# EAGLE design SAMD21 (EAGLE 9.4.2)
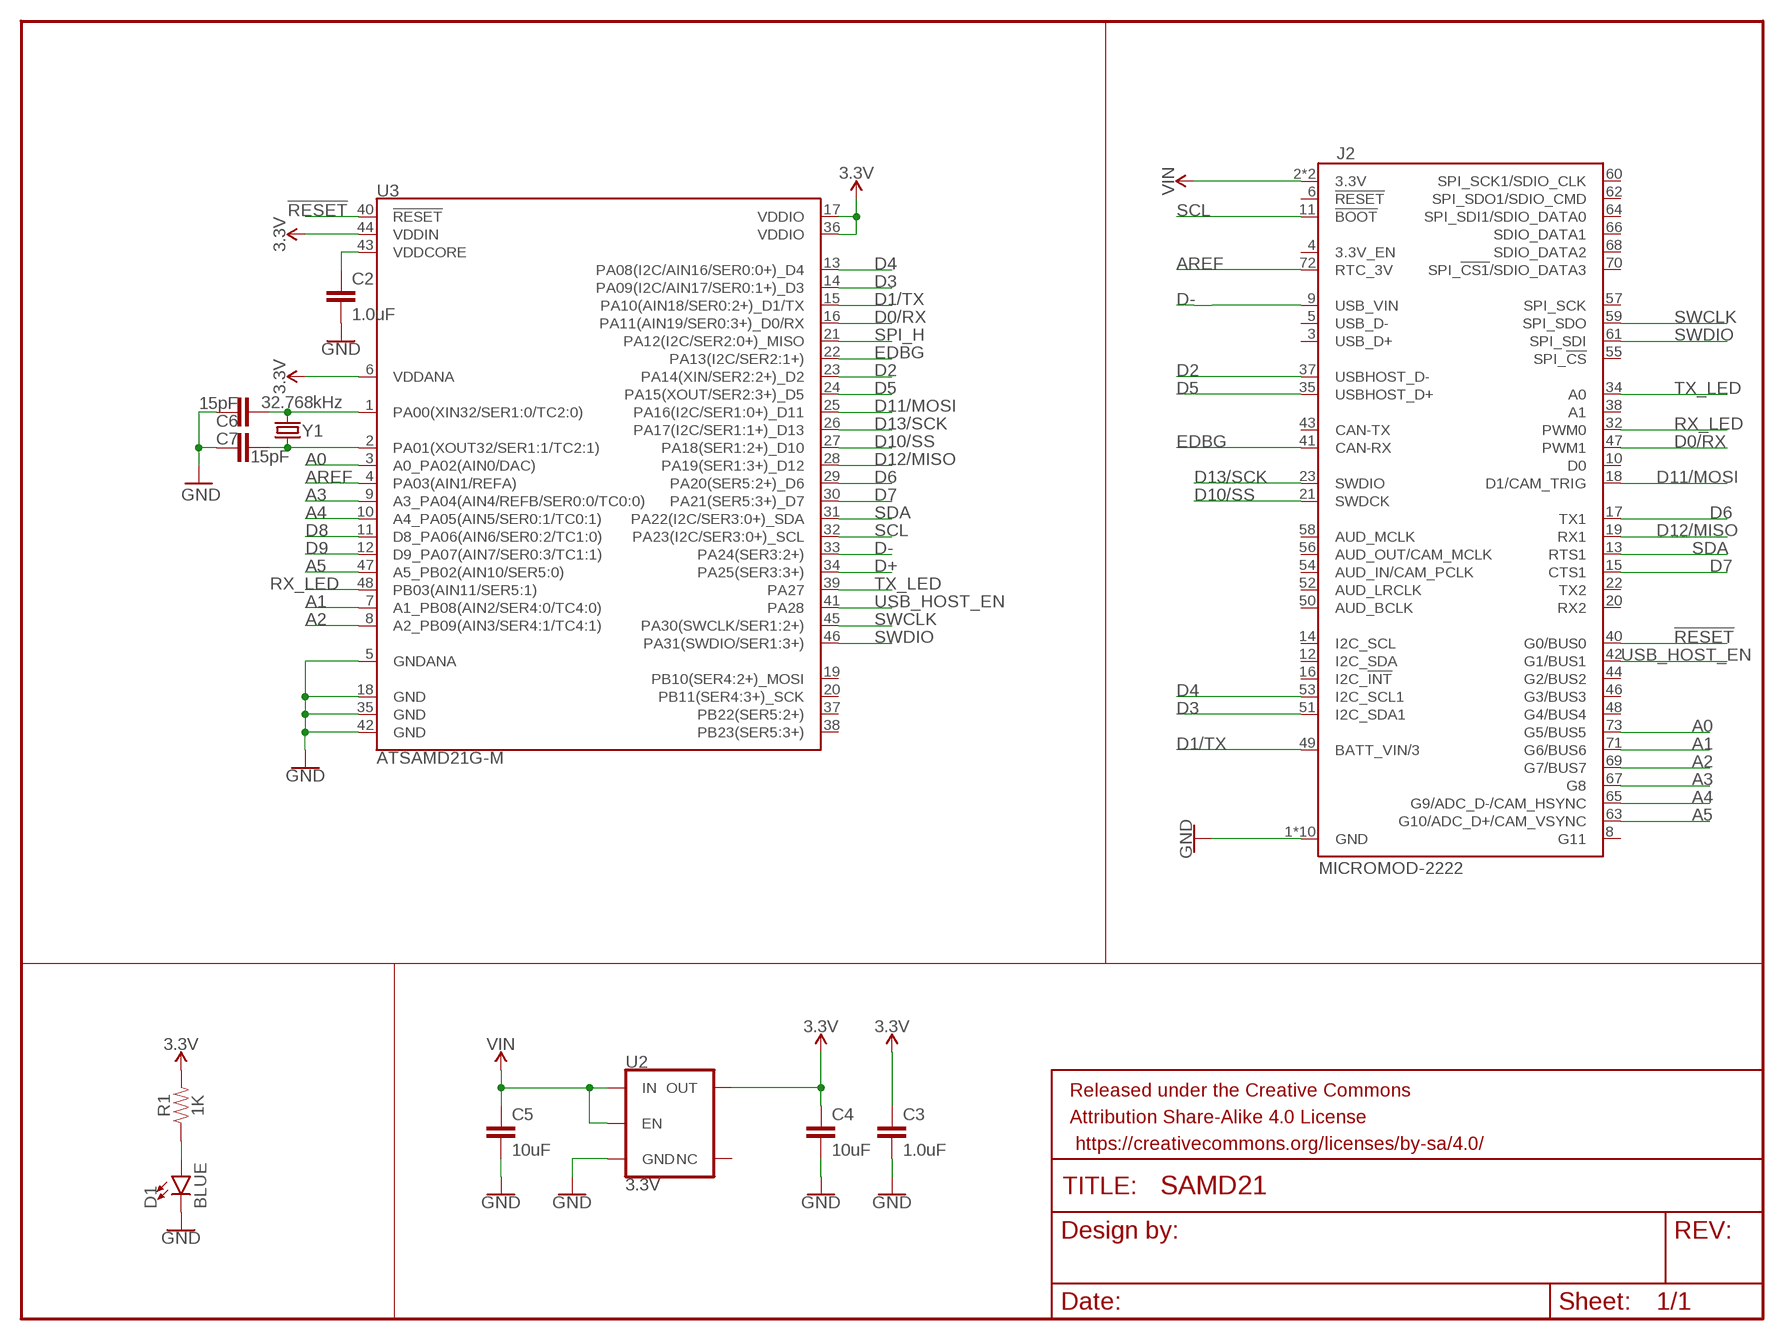
[diagram p0: schematic, sheet 1]

## Parts
C2  1.0uF  1.0UF-0603-16V-10%-X7R  [0603]
C3  1.0uF  1.0UF-0603-16V-10%-X7R  [0603]
C4  10uF  10UF-0603-6.3V-20%  [0603]
C5  10uF  10UF-0603-6.3V-20%  [0603]
C6  15pF  15PF-50V(+-5%)(0402)  [0402-CAP]
C7  15pF  15PF-50V(+-5%)(0402)  [0402-CAP]
D1  BLUE  LED-BLUE0603  [LED-0603]
FRAME1  FRAME-LETTER  [CREATIVE_COMMONS]
J2  MICROMOD-2222  [M.2-CARD-E-22]
R1  1K  0.05OHM-0603-1/5W-1%  [0603]
U2  3.3V  V_REG_AP2112K-3.3V  [SOT23-5]
U3  ATSAMD21G-M  [QFN-48]
Y1  32.768kHz  CRYSTAL3.2X1.5MM  [CRYSTAL-SMD-3.2X1.5MM]

## Nets
3.3V: C3.1 C4.1 R1.2 U2.5(OUT) U3.6(VDDANA) U3.17(VDDIO) U3.36(VDDIO) U3.44(VDDIN)
!RESET: J2.40(G0/BUS0) U3.40(!RESET!)
A0: J2.73(G5/BUS5) U3.3(A0_PA02(AIN0/DAC))
A1: J2.71(G6/BUS6) U3.7(A1_PB08(AIN2/SER4:0/TC4:0))
A2: J2.69(G7/BUS7) U3.8(A2_PB09(AIN3/SER4:1/TC4:1))
A3: J2.67(G8) U3.9(A3_PA04(AIN4/REFB/SER0:0/TC0:0))
A4: J2.65(G9/ADC_D-/CAM_HSYNC) U3.10(A4_PA05(AIN5/SER0:1/TC0:1))
A5: J2.63(G10/ADC_D+/CAM_VSYNC) U3.47(A5_PB02(AIN10/SER5:0))
AREF: J2.72(RTC_3V) U3.4(PA03(AIN1/REFA))
D0/RX: J2.47(PWM1) U3.16(PA11(AIN19/SER0:3+)_D0/RX)
D1/TX: J2.49(BATT_VIN/3) U3.15(PA10(AIN18/SER0:2+)_D1/TX)
D2: J2.37(USBHOST_D-) U3.23(PA14(XIN/SER2:2+)_D2)
D3: J2.51(I2C_SDA1) U3.14(PA09(I2C/AIN17/SER0:1+)_D3)
D4: J2.53(I2C_SCL1) U3.13(PA08(I2C/AIN16/SER0:0+)_D4)
D5: J2.35(USBHOST_D+) U3.24(PA15(XOUT/SER2:3+)_D5)
D6: J2.17(TX1) U3.29(PA20(SER5:2+)_D6)
D7: J2.15(CTS1) U3.30(PA21(SER5:3+)_D7)
D8: U3.11(D8_PA06(AIN6/SER0:2/TC1:0))
D9: U3.12(D9_PA07(AIN7/SER0:3/TC1:1))
D10/SS: J2.21(SWDCK) U3.27(PA18(SER1:2+)_D10)
D11/MOSI: J2.18(D1/CAM_TRIG) U3.25(PA16(I2C/SER1:0+)_D11)
D12/MISO: J2.19(RX1) U3.28(PA19(SER1:3+)_D12)
D13/SCK: J2.23(SWDIO) U3.26(PA17(I2C/SER1:1+)_D13)
D+: U3.34(PA25(SER3:3+))
D-: J2.9(USB_VIN) U3.33(PA24(SER3:2+))
EDBG: J2.41(CAN-RX) U3.22(PA13(I2C/SER2:1+))
GND: C2.2 C3.2 C4.2 C5.2 C6.1 C7.2 D1.C J2.1(GND) J2.7(GND) J2.33(GND) J2.36(GND) J2.39(GND) J2.45(GND) J2.75(GND) J2.GND1(GND) J2.GND2(GND) J2.GND3(GND) U2.2(GND) U3.5(GNDANA) U3.18(GND) U3.35(GND) U3.42(GND)
N$1: D1.A R1.1
N$2: C6.2 U3.1(PA00(XIN32/SER1:0/TC2:0)) Y1.P$2
N$3: C7.1 U3.2(PA01(XOUT32/SER1:1/TC2:1)) Y1.P$1
N$5: C2.1 U3.43(VDDCORE)
RX_LED: J2.32(PWM0) U3.48(PB03(AIN11/SER5:1))
SCL: J2.11(!BOOT!) U3.32(PA23(I2C/SER3:0+)_SCL)
SDA: J2.13(RTS1) U3.31(PA22(I2C/SER3:0+)_SDA)
SPI_H: U3.21(PA12(I2C/SER2:0+)_MISO)
SWCLK: J2.59(SPI_SDO) U3.45(PA30(SWCLK/SER1:2+))
SWDIO: J2.61(SPI_SDI) U3.46(PA31(SWDIO/SER1:3+))
TX_LED: J2.34(A0) U3.39(PA27)
USB_HOST_EN: J2.42(G1/BUS1) U3.41(PA28)
VIN: C5.1 J2.2(3.3V) J2.74(3.3V) U2.1(IN) U2.3(EN)
Unconnected: J2.3(USB_D+) J2.4(3.3V_EN) J2.5(USB_D-) J2.6(!RESET!) J2.8(G11) J2.10(D0) J2.12(I2C_SDA) J2.14(I2C_SCL) J2.16(I2C_!INT!) J2.20(RX2) J2.22(TX2) J2.38(A1) J2.43(CAN-TX) J2.44(G2/BUS2) J2.46(G3/BUS3) J2.48(G4/BUS4) J2.50(AUD_BCLK) J2.52(AUD_LRCLK) J2.54(AUD_IN/CAM_PCLK) J2.55(SPI_!CS!) J2.56(AUD_OUT/CAM_MCLK) J2.57(SPI_SCK) J2.58(AUD_MCLK) J2.60(SPI_SCK1/SDIO_CLK) J2.62(SPI_SDO1/SDIO_CMD) J2.64(SPI_SDI1/SDIO_DATA0) J2.66(SDIO_DATA1) J2.68(SDIO_DATA2) J2.70(SPI_!CS1!/SDIO_DATA3) U2.4(NC) U3.19(PB10(SER4:2+)_MOSI) U3.20(PB11(SER4:3+)_SCK) U3.37(PB22(SER5:2+)) U3.38(PB23(SER5:3+))

## Library data of the parts
C2 C3 = SparkFun-Capacitors:1.0UF: 1µF ceramic capacitors A capacitor is a passive two-terminal electrical component used to store electrical energy temporarily in an electric field.; PROD_ID: CAP-13930
C4 C5 = SparkFun-Capacitors:10UF: 10.0µF ceramic capacitors A capacitor is a passive two-terminal electrical component used to store electrical energy temporarily in an electric field.; PROD_ID: CAP-11015
C6 C7 = samd21-temp:15PF-50V(+-5%)(0402); PROD_ID: CAP-13063
D1 = SparkFun-LED:LED-BLUE: Blue SMD LED Used in manufacturing of various products at SparkFun Packages: 0603 - SMD 0603 package [Product Link] <http://www.digikey.com/product-detail/en/SMLE12BC7TT86/511-1589-2-ND/1641808> 1206 - SMD1206 package [Product Link] <http://www.digikey.com/product-detail/en/lite-on-inc/LTST-C150TBKT/160-1643-1-ND/573584> SparkFun Products: ESP8266 Thing-Dev Board <https://www.sparkfun.com/products/13711> RedBoard <https://www.sparkfun.com/products/12757>; PROD_ID: DIO-08575
FRAME1 = SparkFun-Aesthetics:FRAME-LETTER: Schematic Frame - Letter Standard 8.5x11 US Letter frame
J2 = SparkFun-MicroMod:MICROMOD: MicroMod Connector Description: A card edge connector and mating PCB connector to allow various MicroMod Processor Boards to be coupled with various carrier boards of different capabilities. Based on the M.2 standard.
R1 = SparkFun-Resistors:0.05OHM: 0.05Ω resistor A resistor is a passive two-terminal electrical component that implements electrical resistance as a circuit element. Resistors act to reduce current flow, and, at the same time, act to lower voltage levels within circuits. - Wikipedia; PROD_ID: RES-12535; VALUE: 0.05
U2 = SparkFun-IC-Power:V_REG_AP2112: AP2112 - 600mA CMOS LDO Regulator w/ Enable The AP2112 is CMOS process low dropout linear regulator with enable function, the regulator delivers a guaranteed 600mA (min.) continuous load current. Features Output Voltage Accuracy: ±1.5% Output Current: 600mA (Min.) Foldback Short Current Protection: 50mA Enable Function to Turn ON/OFF VOUT Low Dropout Voltage (3.3V): 250mV (Typ.) @IOUT=600mA Excellent Load Regulation: 0.2%/A (Typ.) Excellent Line Regulation: 0.02%/V (Typ.) Low Quiescent Current: 55μA (Typ.) Low Standby Current: 0.01μA (Typ.) Low Output Noise: 50μVRMS PSRR: 100Hz -65dB, 1kHz -65dB OTSD Protection Stable with 1.0μF Flexible Cap: Ceramic, Tantalum and Aluminum Electrolytic Operation Temperature Range: -40°C to 85°C ESD: MM 400V, HBM 4000V; PROD_ID: VREG-12457
U3 = SparkFun-IC-Microcontroller:ATSAMD21G: Atmel SAMD21G SMART ARM-Based Microcontroller The Atmel ® | SMART ™ SAM D21 is a series of low-power microcontrollers using the 32-bit ARM ® Cortex ® -M0+ processor, and ranging from 32- to 64-pins with up to 256KB Flash and 32KB of SRAM. The SAM D21 devices operate at a maximum frequency of 48MHz and reach 2.46 CoreMark/MHz. They are designed for simple and intuitive migration with identical peripheral modules, hex compatible code, identical linear address map and pin compatible migration paths between all devices in the product series. All devices include intelligent and flexible peripherals, Atmel Event System for inter-peripheral signaling, and support for capacitive touch button, slider and wheel user interfaces. Datasheet <https://cdn.sparkfun.com/datasheets/Dev/Arduino/Boards/Atmel-42181-SAM-D21_Datasheet.pdf> SparkFun Products SparkFun SAMD21 Mini Breakout <https://www.sparkfun.com/products/13664> (DEV-13664) SparkFun SAMD21 Dev Breakout <https://www.sparkfun.com/products/13672> (DEV-13672) (DEV-14926); PROD_ID: IC-13064
Y1 = samd21-temp:CRYSTAL: Various standard crystals. Proven footprints.; PROD_ID: XTAL-13062

## Board
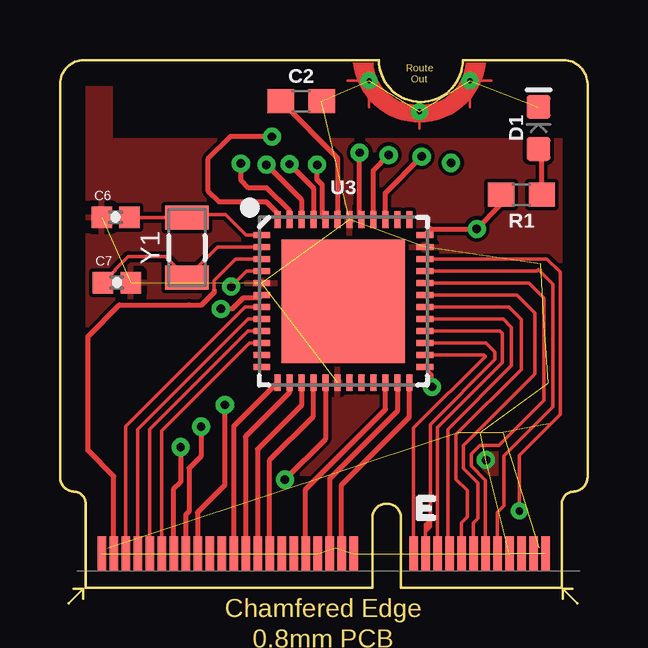
[diagram p1: board, top side]
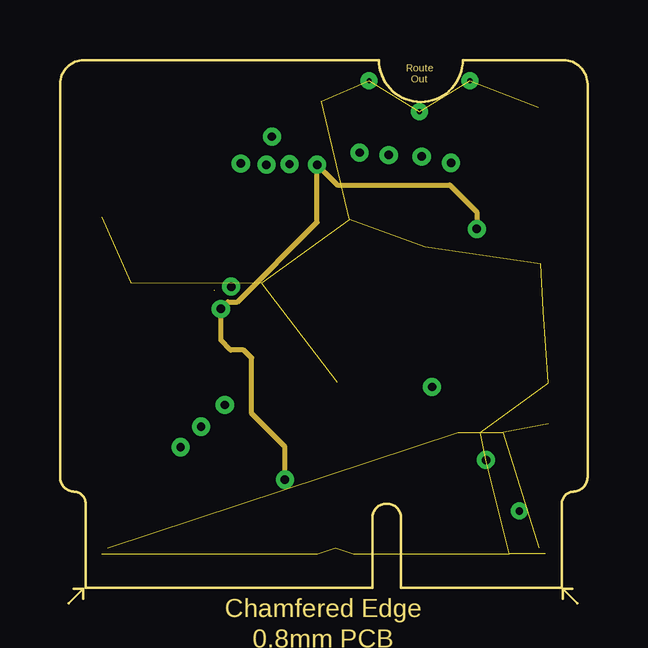
[diagram p2: board, inner layer Route15]
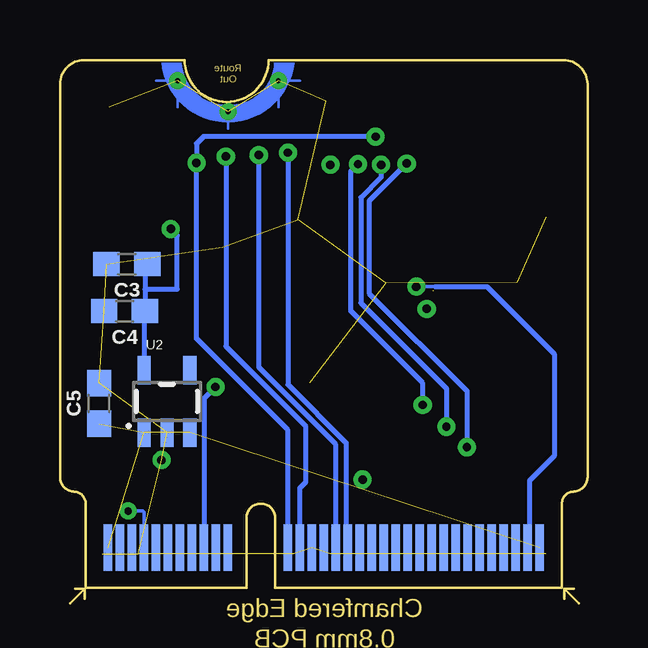
[diagram p3: board, bottom side, seen from below]

Size 22 x 22 mm. Coordinates in mm from the lower left corner, seen from the top.
Outline: 0,4.6 0,21 arc-87 1,22 13.3,22 arc90 15.05,20.25 arc90 16.8,22 21,22 arc-87 22,21 22,4.6
Outline: 0,4.6 arc87 0.6,4
Outline: 21.4,4 arc87 22,4.6
Outline: 21.4,4 arc85 20.93,3.5 20.93,0 14.23,0 14.23,2.9 arc180 13.03,2.9 13.03,0 1.08,0 1.08,3.5 arc84 0.6,4
Outline: 21.4,4 arc87 22,4.6
Outline: 0,4.6 arc87 0.6,4
Copper layers (1+2*15+16): Top 0.035mm / dielectric 1.5mm / Route2 0.035mm / dielectric 0.15mm / Route15 0.035mm / dielectric 0.2mm / Bottom 0.035mm
Design rules "default *": minimum track width 6mil, minimum drill 0.35mm, track to track 6mil, track to pad 6mil, pad to pad 6mil, via to via 6mil, smd to smd 6mil, copper to edge 40mil, drill to drill 6mil, minimum pad ring 10mil, minimum via ring 8mil, stop-mask expansion 4mil, vias tented up to drill 0mil, thermal gap 10mil

### Footprints (pad centres in the part's own frame; a part is rotated, then mirrored left to right if it is on the bottom)
0603 = smd 1.1 x 1: 1 -0.85,0; 2 0.85,0
0402-CAP = smd 0.85 x 0.9: 1 -0.58,0; 2 0.58,0
LED-0603 = smd 1 x 1: A -0.877,0; C 0.877,0
M.2-CARD-E-22 = smd 0.35 x 1.45: 1 9.25,1.275; 3 8.75,1.275; 5 8.25,1.275; 7 7.75,1.275; 9 7.25,1.275; 11 6.75,1.275; 13 6.25,1.275; 15 5.75,1.275; 17 5.25,1.275; 19 4.75,1.275; 21 4.25,1.275; 23 3.75,1.275; 33 1.25,1.275; 35 0.75,1.275; 37 0.25,1.275; 39 -0.25,1.275; 41 -0.75,1.275; 43 -1.25,1.275; 45 -1.75,1.275; 47 -2.25,1.275; 49 -2.75,1.275; 51 -3.25,1.275; 53 -3.75,1.275; 55 -4.25,1.275; 57 -4.75,1.275; 59 -5.25,1.275; 61 -5.75,1.275; 63 -6.25,1.275; 65 -6.75,1.275; 67 -7.25,1.275; 69 -7.75,1.275; 71 -8.25,1.275; 73 -8.75,1.275; 75 -9.25,1.275 | smd 0.35 x 1.95 bottom: 2 9,1.525; 4 8.5,1.525; 6 8,1.525; 8 7.5,1.525; 10 7,1.525; 12 6.5,1.525; 14 6,1.525; 16 5.5,1.525; 18 5,1.525; 20 4.5,1.525; 22 4,1.525; 32 1.5,1.525; 34 1,1.525; 36 0.5,1.525; 38 0,1.525; 40 -0.5,1.525; 42 -1,1.525; 44 -1.5,1.525; 46 -2,1.525; 48 -2.5,1.525; 50 -3,1.525; 52 -3.5,1.525; 54 -4,1.525; 56 -4.5,1.525; 58 -5,1.525; 60 -5.5,1.525; 62 -6,1.525; 64 -6.5,1.525; 66 -7,1.525; 68 -7.5,1.525; 70 -8,1.525; 72 -8.5,1.525; 74 -9,1.525 | drill 0.2: GND1 1.9,21; GND2 4,19.7; GND3 6.1,21
SOT23-5 = smd 0.55 x 1.2: 1 -0.95,-1.3; 2 0,-1.3; 3 0.95,-1.3; 4 0.95,1.3; 5 -0.95,1.3
QFN-48 = smd 0.7 x 0.25: 1 -3.4,2.75; 2 -3.4,2.25; 3 -3.4,1.75; 4 -3.4,1.25; 5 -3.4,0.75; 6 -3.4,0.25; 7 -3.4,-0.25; 8 -3.4,-0.75; 9 -3.4,-1.25; 10 -3.4,-1.75; 11 -3.4,-2.25; 12 -3.4,-2.75; 25 3.4,-2.75; 26 3.4,-2.25; 27 3.4,-1.75; 28 3.4,-1.25; 29 3.4,-0.75; 30 3.4,-0.25; 31 3.4,0.25; 32 3.4,0.75; 33 3.4,1.25; 34 3.4,1.75; 35 3.4,2.25; 36 3.4,2.75 | smd 0.25 x 0.7: 13 -2.75,-3.4; 14 -2.25,-3.4; 15 -1.75,-3.4; 16 -1.25,-3.4; 17 -0.75,-3.4; 18 -0.25,-3.4; 19 0.25,-3.4; 20 0.75,-3.4; 21 1.25,-3.4; 22 1.75,-3.4; 23 2.25,-3.4; 24 2.75,-3.4; 37 2.75,3.4; 38 2.25,3.4; 39 1.75,3.4; 40 1.25,3.4; 41 0.75,3.4; 42 0.25,3.4; 43 -0.25,3.4; 44 -0.75,3.4; 45 -1.25,3.4; 46 -1.75,3.4; 47 -2.25,3.4; 48 -2.75,3.4 | smd 5.15 x 5.15: EP 0,0
CRYSTAL-SMD-3.2X1.5MM = smd 1 x 1.8: P$1 -1.25,0; P$2 1.25,0

### Placement (x,y rotation side)
C2  10.06,20.27 0 top
C3  19.21,13.49 180 bottom
C4  19.3,11.53 180 bottom
C5  20.37,7.68 90 bottom
C6  2.32,15.44 0 top
C7  2.37,12.72 0 top
D1  19.95,19.16 90 top
FRAME1  -6.54,-17.26 0 top  (outside the outline)
J2  10.99,0.14 0 top
R1  19.24,16.38 180 top
U2  17.53,7.76 0 bottom
U3  11.82,11.94 0 top
Y1  5.3,14.17 90 top

### Tracks (layer width: path | path; a pad name or v marks a point on that pad's centre or on a via)
3.3V  (via drill 0.35)
  Top 0.2: U3.36 15.48,14.96 v17.38,14.96 18.39,15.97 R1.2 | U3.6 8.29,12.07 7.63,12.07 7.18,11.62 v6.71,11.62 | U3.44 10.94,15.47 10.94,16.78 10.72,17 v10.72,17.63 | U3.17 11.07,6.19 v9.38,4.5
  Route15 0.2: v17.38,14.96 17.38,15.67 16.26,16.79 11.57,16.79 v10.72,17.63 10.72,15.24 7.4,11.92 7.01,11.92 v6.71,11.62 6.71,10.32 7.12,9.9 7.66,9.9 7.99,9.57 7.99,7.26 9.38,5.87 v9.38,4.5
  Bottom 0.2: 18.45,12.44 18.45,12.45 17.11,12.45 17.11,14.69 v17.38,14.96
  Bottom 0.203: U2.5 18.48,11.5 C4.1 18.45,12.44 18.45,13.39 C3.1
!RESET  (via drill 0.35)
  Top 0.2: U3.40 13.07,17.39 v13.71,18.04
  Bottom 0.2: J2.40 10.5,5.96 13.71,9.18 v13.71,18.04
A0  (1 unrouted)
  Top 0.152: 2.2,1.46 J2.73 | U3.3 7.32,13.69 6.42,12.8 6.42,12.39 6.42,12.38
  Top 0.2: J2.73 2.24,4.64 1.17,5.71 1.17,10.48 2.47,11.78 5.38,11.78 5.91,11.78 6.45,12.32 6.45,12.38 6.45,12.39
A1
  Top 0.152: J2.71 2.75,6.72 7.72,11.69 U3.7
A2
  Top 0.152: J2.69 3.25,6.59 7.85,11.19 U3.8
A3
  Top 0.152: J2.67 3.75,6.59 7.84,10.69 U3.9
A4
  Top 0.152: J2.65 4.25,6.54 7.9,10.19 U3.10
A5  (via drill 0.35)
  Top 0.2: v5.03,5.85 5.03,4.39 4.72,4.09 4.72,1.44 J2.63 | U3.47 9.57,15.72 8.62,16.67 7.87,16.67 7.54,16.99 v7.54,17.68
  Bottom 0.2: v7.54,17.68 9.1,16.12 9.1,12.27 5.03,8.2 v5.03,5.85
AREF  (via drill 0.35)
  Top 0.152: U3.4 7.79,13.19 v7.14,12.55
  Bottom 0.152: v7.14,12.55 6.36,12.55 | J2.72
  Bottom 0.2: 6.36,12.55 4.19,12.55 1.4,9.75 1.4,5.49 2.42,4.46 2.42,1.75 J2.72
D0/RX
  Top 0.2: J2.47 8.75,5.32 10.57,7.14 U3.16
D1/TX
  Top 0.2: U3.15 10.07,7.59 8.24,5.76 J2.49
D2
  Top 0.2: U3.23 14.07,7.36 11.25,4.54 J2.37
D3
  Top 0.2: U3.14 9.57,8.14 7.73,6.3 7.73,1.43 J2.51
D4
  Top 0.2: U3.13 7.25,6.72 J2.53
D5
  Top 0.2: J2.35 11.75,4.28 14.57,7.11 U3.24
D6
  Top 0.152: U3.29 18.48,11.19 18.83,10.84 18.83,9.26 16.17,6.6 16.17,1.49 J2.17
D7
  Top 0.152: U3.30 18.71,11.69 19.24,11.17 19.24,9.1 16.51,6.38 16.51,4.52 16.98,4.05 16.98,2.94 16.75,2.7 J2.15
D10/SS
  Top 0.152: U3.27 17.76,10.19 18.13,9.82 18.13,9.5 15.44,6.81 15.44,2.83 | 15.44,2.83 15.44,2.52 15.25,2.33 J2.21 15.25,2.47 | 15.25,2.47 15.25,2.63 15.3,2.68 | 15.3,2.68 15.44,2.83 | 15.25,2.47 15.3,2.52 15.3,2.68
D11/MOSI  (via drill 0.35)
  Top 0.152: U3.25 15.51,8.9 v15.51,8.36
  Bottom 0.2: v15.51,8.36 16,7.88 J2.18
D12/MISO
  Top 0.152: J2.19 15.75,6.68 18.45,9.38 18.45,10.6 18.34,10.71 15.23,10.71 U3.28
D13/SCK
  Top 0.152: J2.23 14.75,6.65 17.73,9.64 17.68,9.69 U3.26
D+  (via drill 0.3)
  Top 0.152: U3.34 20.31,13.69 20.86,13.15 20.86,7.21 19.16,5.52 v19.16,3.19
  Bottom 0.152: v19.16,3.19 18.55,3.19 18.49,3.13 18.49,2.2 18.5,2.19
D-
  Top 0.152: U3.33 19.88,13.19 19.94,13.26 20.55,12.65 20.55,7.53 18.52,5.5 18.52,3.41 18.25,3.14 J2.9
EDBG
  Top 0.2: J2.41 10.25,4.1 13.58,7.43 13.58,8.53 U3.22
GND  (via drill 0.35)  (22 unrouted)
  other vias: 17.76,5.32
  pour Top: 0.9,20.81 0.9,4.76 21.13,4.76 21.13,18.65 16.27,18.65 2.12,18.65 2.12,20.83 2.12,21.39 0.88,21.39 0.88,20.58 0.88,20.58
N$1
  Top 0.2: R1.1 20.09,18.15 D1.A
N$2
  Top 0.152: U3.1 7.76,14.69 6.9,15.55 5.42,15.55 Y1.P$2 2.92,15.42 C6.2
N$3
  Top 0.152: C7.1 2.3,13.22 2.3,13.26 2.85,13.81 4.41,13.81 Y1.P$1 6.56,14.19 U3.2
N$5
  Top 0.2: C2.1 11.57,17.92 U3.43
RX_LED  (via drill 0.35)
  Top 0.2: v8.84,18.8 7.11,18.8 6.16,17.86 6.16,16.55 6.63,16.08 8.6,16.08 9.07,15.62 U3.48
  Bottom 0.2: v8.84,18.8 16.02,18.8 16.31,18.51 v16.31,17.71 16.31,10.38 12.5,6.57 J2.32
SCL
  Top 0.152: J2.11 17.75,4.48 17.16,5.07 17.16,5.57 17.51,5.93 18.3,5.93 20.17,7.8 20.17,12.08 19.56,12.69 U3.32
SDA
  Top 0.152: U3.31 19.05,12.19 19.8,11.44 19.8,8.91 16.82,5.93 16.82,4.97 17.42,4.36 17.43,4.36 17.43,2.89 17.25,2.7 J2.13
SWCLK  (via drill 0.35)
  Top 0.2: v9.57,17.66 10.57,16.66 U3.45 | v6.87,7.61 6.87,4.27 5.73,3.13 J2.59
  Bottom 0.2: v6.87,7.61 6.87,8.53 9.87,11.52 9.87,17.36 v9.57,17.66
SWDIO  (via drill 0.35)
  Top 0.2: v8.61,17.63 10.07,16.17 U3.46 | v5.88,6.71 5.88,5.47 5.38,4.97 5.38,3.17 5.25,3.04 J2.61
  Bottom 0.2: v8.61,17.63 8.61,17.11 9.46,16.27 9.46,11.87 5.88,8.3 v5.88,6.71
TX_LED  (via drill 0.35)
  Top 0.2: U3.39 13.57,16.46 v15.08,17.97
  Bottom 0.2: v15.08,17.97 15.08,10.05 11.74,6.71 11.74,4.4 12,4.15 J2.34
USB_HOST_EN  (via drill 0.35)
  Top 0.2: U3.41 12.49,15.41 v12.49,18.14
  Bottom 0.2: v12.49,18.14 12.49,8.46 10.07,6.04 10.07,1.74 J2.42
VIN  (4 unrouted)